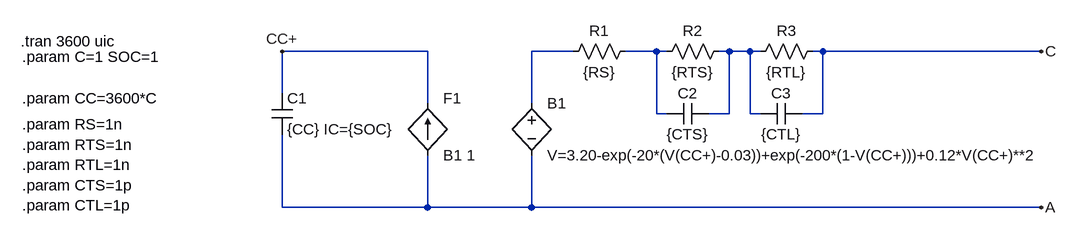
[diagram p0: schematic battery.asc]
battery.asc, the LTspice schematic file:
Version 4
SHEET 1 1448 680
WIRE 352 32 128 32
WIRE 576 32 512 32
WIRE 704 32 656 32
WIRE 720 32 704 32
WIRE 816 32 800 32
WIRE 848 32 816 32
WIRE 864 32 848 32
WIRE 960 32 944 32
WIRE 1296 32 960 32
WIRE 128 96 128 32
WIRE 352 112 352 32
WIRE 512 112 512 32
WIRE 704 128 704 32
WIRE 720 128 704 128
WIRE 816 128 816 32
WIRE 816 128 784 128
WIRE 848 128 848 32
WIRE 864 128 848 128
WIRE 960 128 960 32
WIRE 960 128 928 128
WIRE 128 272 128 160
WIRE 352 272 352 192
WIRE 352 272 128 272
WIRE 512 272 512 192
WIRE 512 272 352 272
WIRE 1296 272 512 272
FLAG 128 32 CC+
FLAG 1296 32 C
FLAG 1296 272 A
SYMBOL cap 112 96 R0
SYMATTR InstName C1
SYMATTR Value {CC} IC={SOC}
SYMBOL res 560 48 R270
WINDOW 0 32 56 VTop 0
WINDOW 3 0 56 VBottom 0
SYMATTR InstName R1
SYMATTR Value {RS}
SYMBOL res 704 48 R270
WINDOW 0 32 56 VTop 0
WINDOW 3 0 56 VBottom 0
SYMATTR InstName R2
SYMATTR Value {RTS}
SYMBOL res 848 48 R270
WINDOW 0 32 56 VTop 0
WINDOW 3 0 56 VBottom 0
SYMATTR InstName R3
SYMATTR Value {RTL}
SYMBOL cap 784 112 R90
WINDOW 0 0 32 VBottom 0
WINDOW 3 32 32 VTop 0
SYMATTR InstName C2
SYMATTR Value {CTS}
SYMBOL cap 928 112 R90
WINDOW 0 0 32 VBottom 0
WINDOW 3 32 32 VTop 0
SYMATTR InstName C3
SYMATTR Value {CTL}
SYMBOL bv 512 96 R0
SYMATTR InstName B1
SYMATTR Value V=3.20-exp(-20*(V(CC+)-0.03))+exp(-200*(1-V(CC+)))+0.12*V(CC+)**2
SYMBOL f 352 192 M180
WINDOW 0 24 88 Left 0
WINDOW 3 24 0 Left 0
SYMATTR InstName F1
SYMATTR Value B1 1
TEXT -272 104 Left 0 !.param CC=3600*C
TEXT -272 40 Left 0 !.param C=1 SOC=1
TEXT -272 144 Left 0 !.param RS=1n\n.param RTS=1n\n.param RTL=1n\n.param CTS=1p\n.param CTL=1p
TEXT -274 16 Left 0 !.tran 3600 uic

The netlist it stands for:
* battery.asc
C1 CC+ A {CC} IC={SOC}
R1 N001 N002 {RS}
R2 N002 N003 {RTS}
R3 N003 C {RTL}
C2 N003 N002 {CTS}
C3 C N003 {CTL}
B1 N001 A V=3.20-exp(-20*(V(CC+)-0.03))+exp(-200*(1-V(CC+)))+0.12*V(CC+)**2
F1 A CC+ B1 1
.param CC=3600*C
.param C=1 SOC=1
.param RS=1n
.param RTS=1n
.param RTL=1n
.param CTS=1p
.param CTL=1p
.tran 3600 uic
.backanno
.end